# Altium schematic sheet 03b3_USB_HUB.SchDoc
size 375 x 258 mm; SheetNumber: 4
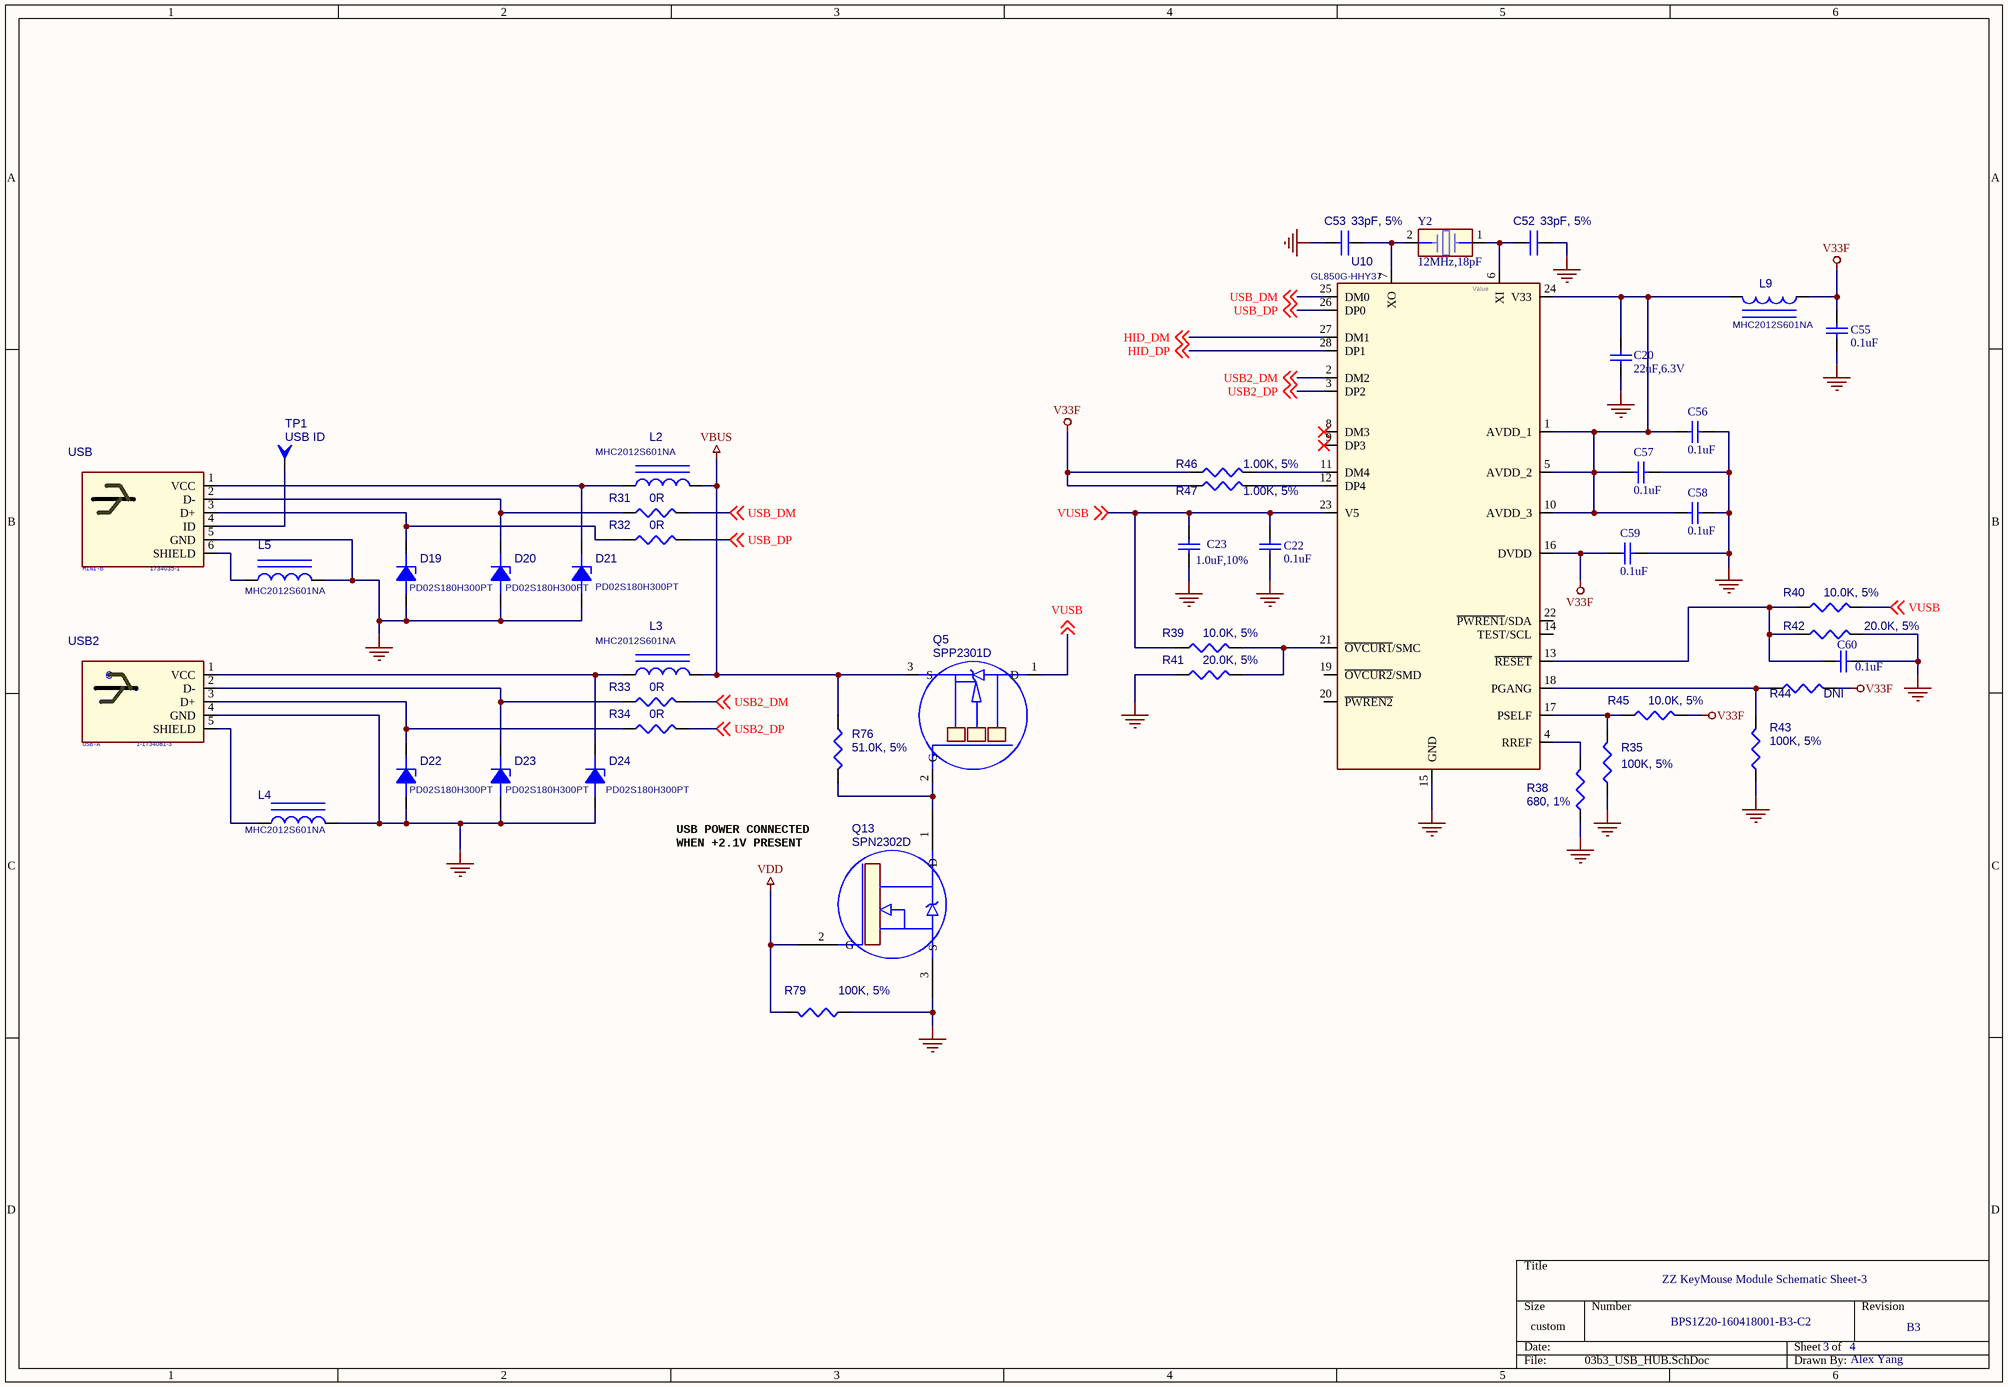
[diagram p0: 03b3_USB_HUB.SchDoc]

## Parts
C20  22uF,6.3V  [MIN0805]
C22  0.1uF  [0603]
C23  1.0uF,10%  [0603]
C52  33pF, 5%  [0402]
C53  33pF, 5%  [0402]
C55  0.1uF  [0603]
C56  0.1uF  [0603]
C57  0.1uF  [0603]
C58  0.1uF  [0603]
C59  0.1uF  [0603]
C60  0.1uF  [0603]
D19  PD02S180H300PT  [ON_SEMI_ESD9L_SOD923]
D20  PD02S180H300PT  [ON_SEMI_ESD9L_SOD923]
D21  PD02S180H300PT  [ON_SEMI_ESD9L_SOD923]
D22  PD02S180H300PT  [ON_SEMI_ESD9L_SOD923]
D23  PD02S180H300PT  [ON_SEMI_ESD9L_SOD923]
D24  PD02S180H300PT  [ON_SEMI_ESD9L_SOD923]
L2  MHC2012S601NA  [RESC2012X70]
L3  MHC2012S601NA  [RESC2012X70]
L4  MHC2012S601NA  [RESC2012X70]
L5  MHC2012S601NA  [RESC2012X70]
L9  MHC2012S601NA  [RESC2012X70]
Q5  SPP2301D  [SOT23]
Q13  SPN2302D  [SOT23]
R31  0R  [0402]
R32  0R  [0402]
R33  0R  [0402]
R34  0R  [0402]
R35  100K, 5%  [0402]
R38  680, 1%  [0402]
R39  10.0K, 5%  [0402]
R40  10.0K, 5%  [0402]
R41  20.0K, 5%  [0402]
R42  20.0K, 5%  [0402]
R43  100K, 5%  [0402]
R44  DNI  [0402]
R45  10.0K, 5%  [0402]
R46  1.00K, 5%  [0402]
R47  1.00K, 5%  [0402]
R76  51.0K, 5%  [0402]
R79  100K, 5%  [0402]
TP1  USB ID  [TP1.5MM]
U10  GL850G-HHY37  [SSOP28]
USB  1734035-1  [MINI-B_TE_1734035-1]
USB2  1-1734081-3  [TE_1-1734081-3]
Y2  12MHz,18pF  FREQUENCY: Value  [TXC_HC-49S]

## Nets
GND: C20.2 C22.1 C23.1 C52.1 C53.2 C55.1 C56.2 C57.2 C58.2 C59.2 C60.1 D19.A(ANODE) D20.A(ANODE) D21.A(ANODE) D22.A(ANODE) D23.A(ANODE) D24.A(ANODE) L4.2 L5.2 Q13.3(S) R35.1 R38.2 R41.1 R42.2 R43.1 R79.1 U10.15(GND) USB.5(GND) USB2.4(GND)
V33F: C55.2 C59.1 L9.1 R44.2 R45.2 R46.1 R47.1 U10.16(DVDD)
VBUS: L2.2 L3.2 Q5.3(S) R76.1
VDD: Q13.2(G) R79.2
HID_DM: U10.27(DM1) ; off-sheet HID_DM
HID_DP: U10.28(DP1) ; off-sheet HID_DP
USB2_DM: R33.2 U10.2(DM2) ; off-sheet USB2_DM
USB2_DP: R34.2 U10.3(DP2) ; off-sheet USB2_DP
USB_DM: R31.2 U10.25(DM0) ; off-sheet USB_DM
USB_DP: R32.2 U10.26(DP0) ; off-sheet USB_DP
VUSB: C22.2 C23.2 Q5.1(D) R39.1 R40.2 U10.23(V5) ; off-sheet VUSB
NetC20_1: C20.1 C56.1 C57.1 C58.1 L9.2 U10.1(AVDD_1) U10.5(AVDD_2) U10.10(AVDD_3) U10.24(V33)
NetC52_2: C52.2 U10.6(XI) Y2.1
NetC53_1: C53.1 U10.7(XO) Y2.2
NetC60_2: C60.2 R40.1 R42.1 U10.13(~{RESET})
NetD19_K: D19.K(CATHODE) R32.1 USB.3(D+)
NetD20_K: D20.K(CATHODE) R31.1 USB.2(D-)
NetD21_K: D21.K(CATHODE) L2.1 USB.1(VCC)
NetD22_K: D22.K(CATHODE) R34.1 USB2.3(D+)
NetD23_K: D23.K(CATHODE) R33.1 USB2.2(D-)
NetD24_K: D24.K(CATHODE) L3.1 USB2.1(VCC)
NetL4_1: L4.1 USB2.5(SHIELD)
NetL5_1: L5.1 USB.6(SHIELD)
NetQ5_2: Q5.2(G) Q13.1(D) R76.2
NetR35_2: R35.2 R45.1 U10.17(PSELF)
NetR38_1: R38.1 U10.4(RREF)
NetR39_2: R39.2 R41.2 U10.21(~{OVCUR1}/SMC)
NetR43_2: R43.2 R44.1 U10.18(PGANG)
NetR46_2: R46.2 U10.11(DM4)
NetR47_2: R47.2 U10.12(DP4)
NetTP1_1: TP1.1(TP) USB.4(ID)

Not connected (* = marked no-connect by the designer): U10 8(DM3)* 9(DP3)* 14(TEST/SCL) 19(~{OVCUR2}/SMD) 20(~{PWREN2}) 22(~{PWREN1}/SDA)

## Notes on the sheet
- (near Q13) USB POWER CONNECTED
  WHEN +2.1V PRESENT
- ZZ KeyMouse Module Schematic Sheet-3
- BPS1Z20-160418001-B3-C2
- B3
- 3
- 4
- Alex Yang
- (in symbol USB-A_1) USB-A
- (in symbol USB-MINI-B_0) MINI-B

## Library data of the parts
C20 C22 C23 C55-C60 = Cap: Capacitor
C52 C53 = CAPACITOR NON-POL
D19-D24 = DIODE BREAKDOWN
L2-L5 L9 = INDUCTOR IRON
Q5 = AO3435
Q13 = AO3416
R31-R35 R38-R47 R76 R79 = R
TP1 = T POINT A
U10 = GL850G-HHY37_0
USB = USB-MINI-B_0
USB2 = USB-A_1
Y2 = XTAL-25MHz_0: XTAL_CS10-25.000,18PF; CAVM PN: 100-150R; OriginalSymbolOrigin: (-50,50); NEEDS_NO_SIZE: TRUE; PATH: ?; CL: ?